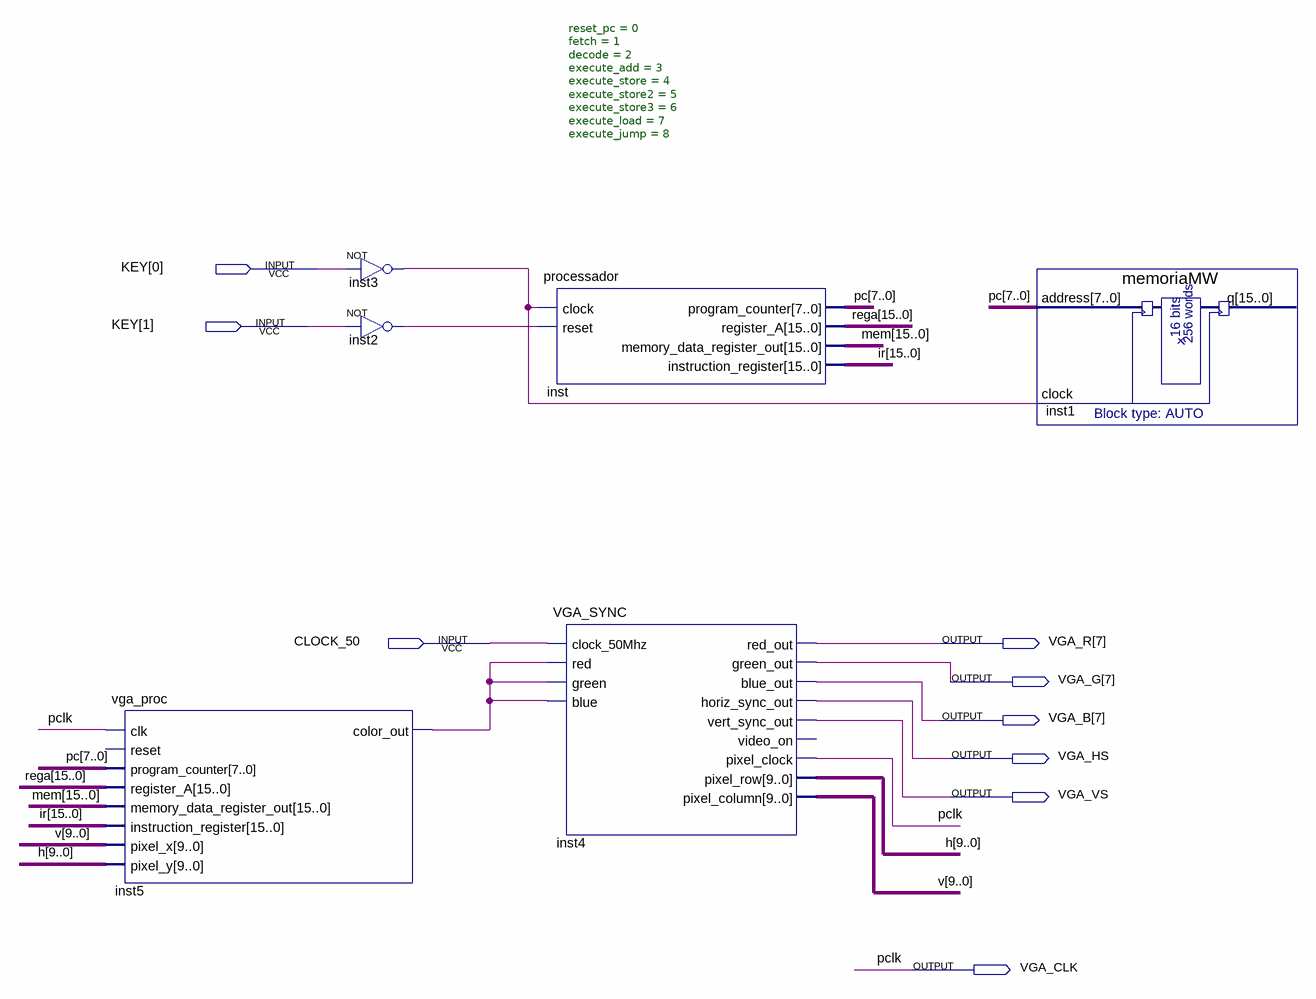
[diagram p0: schematic sheet]
// Quartus schematic Block1.bdf as structural Verilog: 6 symbols, 9 pins
module Block1 (
  input  [1:0] KEY,
  input  CLOCK_50,
  output [7:7] VGA_R,
  output [7:7] VGA_G,
  output [7:7] VGA_B,
  output VGA_HS,
  output VGA_VS,
  output VGA_CLK
);

  wire inst2_out, inst3_out, inst5_color_out;
  wire [7:0] pc;
  wire [9:0] h, v;
  wire [15:0] ir, mem, rega;

  vga_proc inst5 (
    .clk(VGA_CLK), .program_counter(pc), .register_A(rega), .memory_data_register_out(mem),
    .instruction_register(ir), .pixel_x(v), .pixel_y(h), .color_out(inst5_color_out));  // open: reset
  not inst3 (inst3_out, KEY[0]);
  not inst2 (inst2_out, KEY[1]);
  processador #(.reset_pc(0), .fetch(1), .decode(2), .execute_add(3), .execute_store(4), .execute_store2(5), .execute_store3(6), .execute_load(7), .execute_jump(8)) inst (
    .clock(inst3_out), .reset(inst2_out), .program_counter(pc), .register_A(rega),
    .memory_data_register_out(mem), .instruction_register(ir));
  VGA_SYNC inst4 (
    .clock_50Mhz(CLOCK_50), .red(inst5_color_out), .green(inst5_color_out), .blue(inst5_color_out),
    .red_out(VGA_R[7]), .green_out(VGA_G[7]), .blue_out(VGA_B[7]), .horiz_sync_out(VGA_HS),
    .vert_sync_out(VGA_VS), .pixel_clock(VGA_CLK), .pixel_row(h), .pixel_column(v));  // open: video_on
  memoriaMW inst1 (.address(pc), .clock(inst3_out));  // open: q

  // Other names for the same wires on the sheet: pclk = VGA_CLK
endmodule
